# Altium project Dual Power 5V.PrjPcb
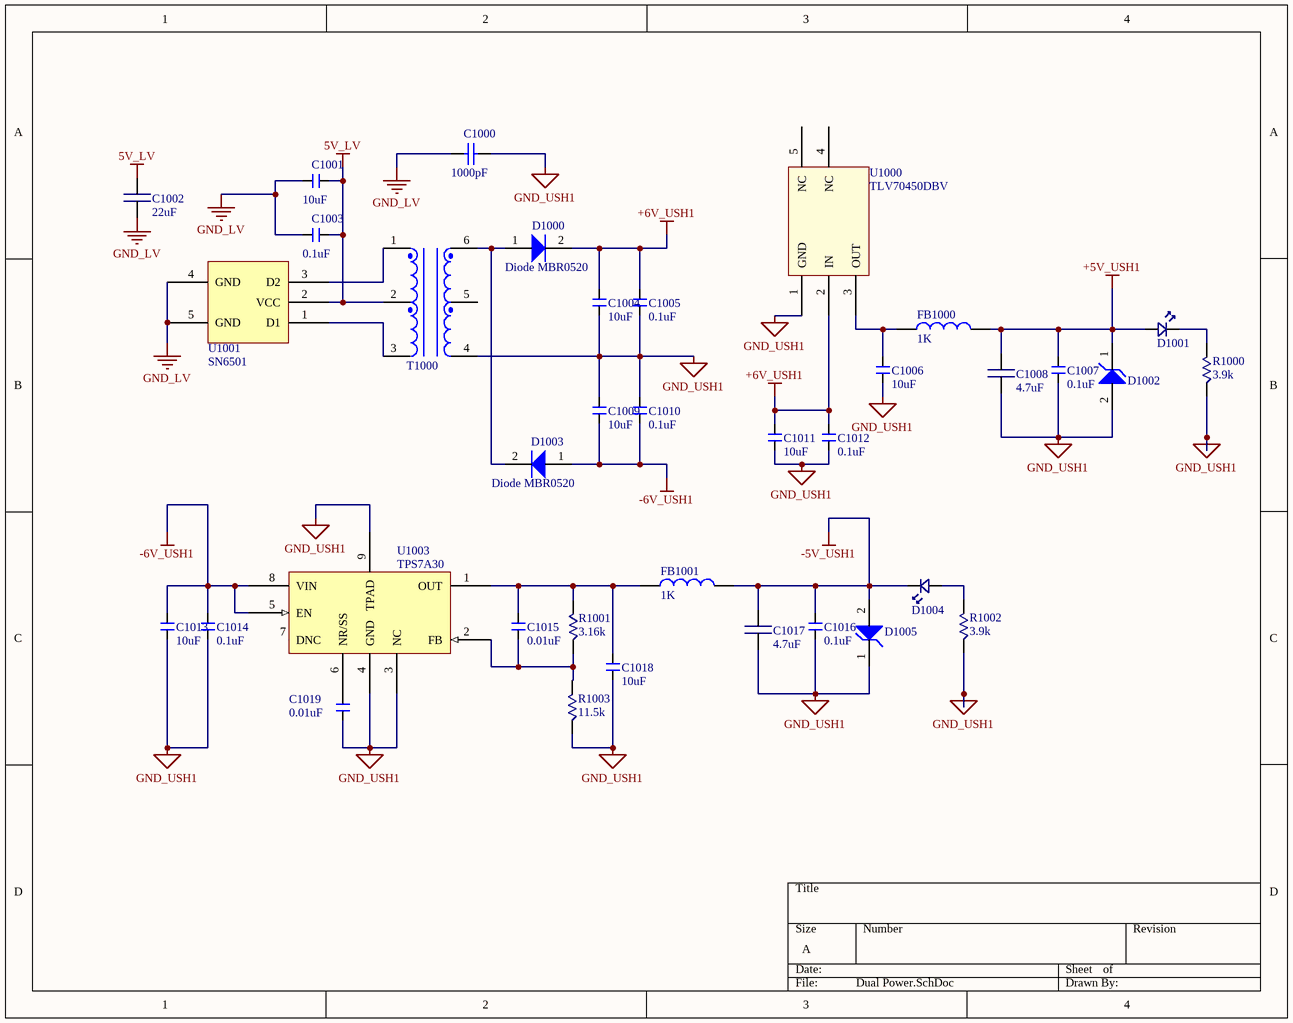
[diagram p0: Dual Power.SchDoc]
1 sheet, 36 parts. Net scope: global (net labels, ports and power ports of the same name join across sheets).
Board file: Dual Power.PcbDoc

## Sheet Dual Power.SchDoc
size A

### Parts
C1000  value 1000pF  [RAD-0.3]  (hidden comment: Cap TH)
C1001  value 10uF  [0603 (1608 Metric)]  (hidden comment: Cap 0603_new)
C1002  value 22uF  [0805 (2012 metric)]  (hidden comment: Cap 0805)
C1003  value 0.1uF  [0603 (1608 Metric)]  (hidden comment: Cap 0603_new)
C1004  value 10uF  [0603 (1608 Metric)]  (hidden comment: Cap 0603_new)
C1005  value 0.1uF  [0603 (1608 Metric)]  (hidden comment: Cap 0603_new)
C1006  value 10uF  [0603 (1608 Metric)]  (hidden comment: Cap 0603_new)
C1007  value 0.1uF  [0603 (1608 Metric)]  (hidden comment: Cap 0603_new)
C1008  value 4.7uF  [0805 (2012 metric)]  (hidden comment: Cap 0805)
C1009  value 10uF  [0603 (1608 Metric)]  (hidden comment: Cap 0603_new)
C1010  value 0.1uF  [0603 (1608 Metric)]  (hidden comment: Cap 0603_new)
C1011  value 10uF  [0603 (1608 Metric)]  (hidden comment: Cap 0603_new)
C1012  value 0.1uF  [0603 (1608 Metric)]  (hidden comment: Cap 0603_new)
C1013  value 10uF  [0603 (1608 Metric)]  (hidden comment: Cap 0603_new)
C1014  value 0.1uF  [0603 (1608 Metric)]  (hidden comment: Cap 0603_new)
C1015  value 0.01uF  [0603 (1608 Metric)]  (hidden comment: Cap 0603_new)
C1016  value 0.1uF  [0603 (1608 Metric)]  (hidden comment: Cap 0603_new)
C1017  value 4.7uF  [0805 (2012 metric)]  (hidden comment: Cap 0805)
C1018  value 10uF  [0603 (1608 Metric)]  (hidden comment: Cap 0603_new)
C1019  value 0.01uF  [0603 (1608 Metric)]  (hidden comment: Cap 0603_new)
D1000  Diode MBR0520  [SOD-123]
D1001  LED  [0805 (2012 Metric) Diode]  (value not drawn)
D1002  Diode Zener POWERDI123  [POWERDI]  (value not drawn)
D1003  Diode MBR0520  [SOD-123]
D1004  LED  [0805 (2012 Metric) Diode]  (value not drawn)
D1005  Diode Zener POWERDI123  [POWERDI]  (value not drawn)
FB1000  value 1K  [0603 (1608 Metric)]  (hidden comment: Ferrite bead)
FB1001  value 1K  [0603 (1608 Metric)]  (hidden comment: Ferrite bead)
R1000  value 3.9k  [0603 (1608 Metric)]  (hidden comment: Resistor 0603)
R1001  value 3.16k  [0603 (1608 Metric)]  (hidden comment: Resistor 0603)
R1002  value 3.9k  [0603 (1608 Metric)]  (hidden comment: Resistor 0603)
R1003  value 11.5k  [0603 (1608 Metric)]  (hidden comment: Resistor 0603)
T1000  750313769  [Xmr SN6501]  (value not drawn)
U1000  TLV70450DBV  [SOT23-5]
U1001  SN6501  [SOT23-5]
U1003  TPS7A30  [8-TSSOP]

### Nets
5V_LV: C1001.2(OUT) C1002.2(OUT) C1003.2(OUT) T1000.2 U1001.2(VCC)
+5V_USH1: C1007.2(OUT) C1008.2(OUT) D1001.A D1002.1(Anode) FB1000.2(OUT)
+6V_USH1: C1004.2(OUT) C1005.2(OUT) C1011.2(OUT) C1012.2(OUT) D1000.2(Anode) U1000.2(IN)
-5V_USH1: C1016.2(OUT) C1017.2(OUT) D1004.K D1005.2(Anode) FB1001.2(OUT)
-6V_USH1: C1009.1(OUT) C1010.1(OUT) C1013.2(OUT) C1014.2(OUT) D1003.1(Anode) U1003.5(EN) U1003.8(VIN)
GND_LV: C1000.1 C1001.1(OUT) C1002.1(OUT) C1003.1(OUT) U1001.4(GND) U1001.5(GND)
GND_USH1: C1000.2 C1004.1(OUT) C1005.1(OUT) C1006.1(OUT) C1007.1(OUT) C1008.1(OUT) C1009.2(OUT) C1010.2(OUT) C1011.1(OUT) C1012.1(OUT) C1013.1(OUT) C1014.1(OUT) C1016.1(OUT) C1017.1(OUT) C1018.1(OUT) C1019.1(OUT) D1002.2(Anode) D1005.1(Anode) R1000.1(A) R1002.1(A) R1003.1(A) T1000.4 U1000.1(GND) U1003.3(NC) U1003.4(GND) U1003.9(TPAD)
NetC1006_2: C1006.2(OUT) FB1000.1(OUT) U1000.3(OUT)
NetC1015_1: C1015.1(OUT) C1018.2(OUT) FB1001.1(OUT) R1001.2(A) U1003.1(OUT)
NetC1015_2: C1015.2(OUT) R1001.1(A) R1003.2(A) U1003.2(FB)
NetC1019_2: C1019.2(OUT) U1003.6(NR/SS)
NetD1000_1: D1000.1(Anode) D1003.2(Anode) T1000.6
NetD1001_K: D1001.K R1000.2(A)
NetD1004_A: D1004.A R1002.2(A)
NetT1000_1: T1000.1 U1001.3(D2)
NetT1000_3: T1000.3 U1001.1(D1)

Not connected (* = marked no-connect by the designer): T1000 5(1); U1000 4(NC) 5(NC); U1003 7(DNC)

### Library data of the parts
C1000 = Cap: CAP CER 1000PF 1KV Y5P RADIAL; Part: 1251PH-ND; Published: 8-Jun-2000; LatestRevisionDate: 17-Jul-2002; LatestRevisionNote: Re-released for DXP Platform.; PackageReference: RAD-0.3; Publisher: Altium Limited; PackageDescription: Radial Cap, Thru-Hole; 2 Leads; 0.3 in Pin Spacing
C1001 C1004 C1006 C1009 C1011 C1013 C1018 = Cap 0603_new: CAP CER 10UF 35V X5R 0805; part: 490-10515-1-ND
C1002 = Cap 0805: CAP CER 22UF 35V X5R 0805; Part: 445-14428-1-ND
C1003 C1005 C1007 C1010 C1012 C1014 C1016 = Cap 0603_new: CAP CER 0.1UF 50V Y5V 0603; part: 311-1343-6-ND
C1008 C1017 = Cap 0805: CAP CER 4.7UF 50V X5R 0805; Part: 445-5980-1-ND
C1015 C1019 = Cap 0603_new: CAP CER 10000PF 100V X7R 0603; part: 478-7418-1-ND
D1000 D1003 = Diode MBR0520: DIODE SCHOTTKY 20V 500MA SOD123; Part: MBR0520LT1GOSCT-ND; Value: *
D1001 D1004 = LED: LED 0805
FB1000 FB1001 = Ferrite bead: FERRITE BEAD 1 KOHM 0603 1LN; Part: 445-8672-1-ND
R1000 R1002 = Resistor 0603: RES SMD 3.9K OHM 5% 1/10W 0603; Part: 541-3.9KGCT-ND
R1001 = Resistor 0603: RES SMD 3.16K OHM 1% 1/10W 0603; Part: 311-3.16KHRCT-ND
R1003 = Resistor 0603: RES SMD 11.5K OHM 1% 1/10W 0603; Part: 541-11.5KHCT-ND
T1000 = 750313769: TRANSFORMER SMD TR1.7 SN6501; Part: 1297-1107-1-ND
U1000 = TLV70450DBV: IC REG LDO 5V 0.15A SOT23-5; Part: 296-39287-1-ND
U1001 = SN6501: IC REG CONV PWR SUPPLIES SOT23-5; Part: *; Value: *
U1003 = TPS7A30: IC REG LDO NEG ADJ 0.2A 8MSOP; Part: 296-27750-1-ND
D1002 D1005 = Diode Zener POWERDI123: Value: *